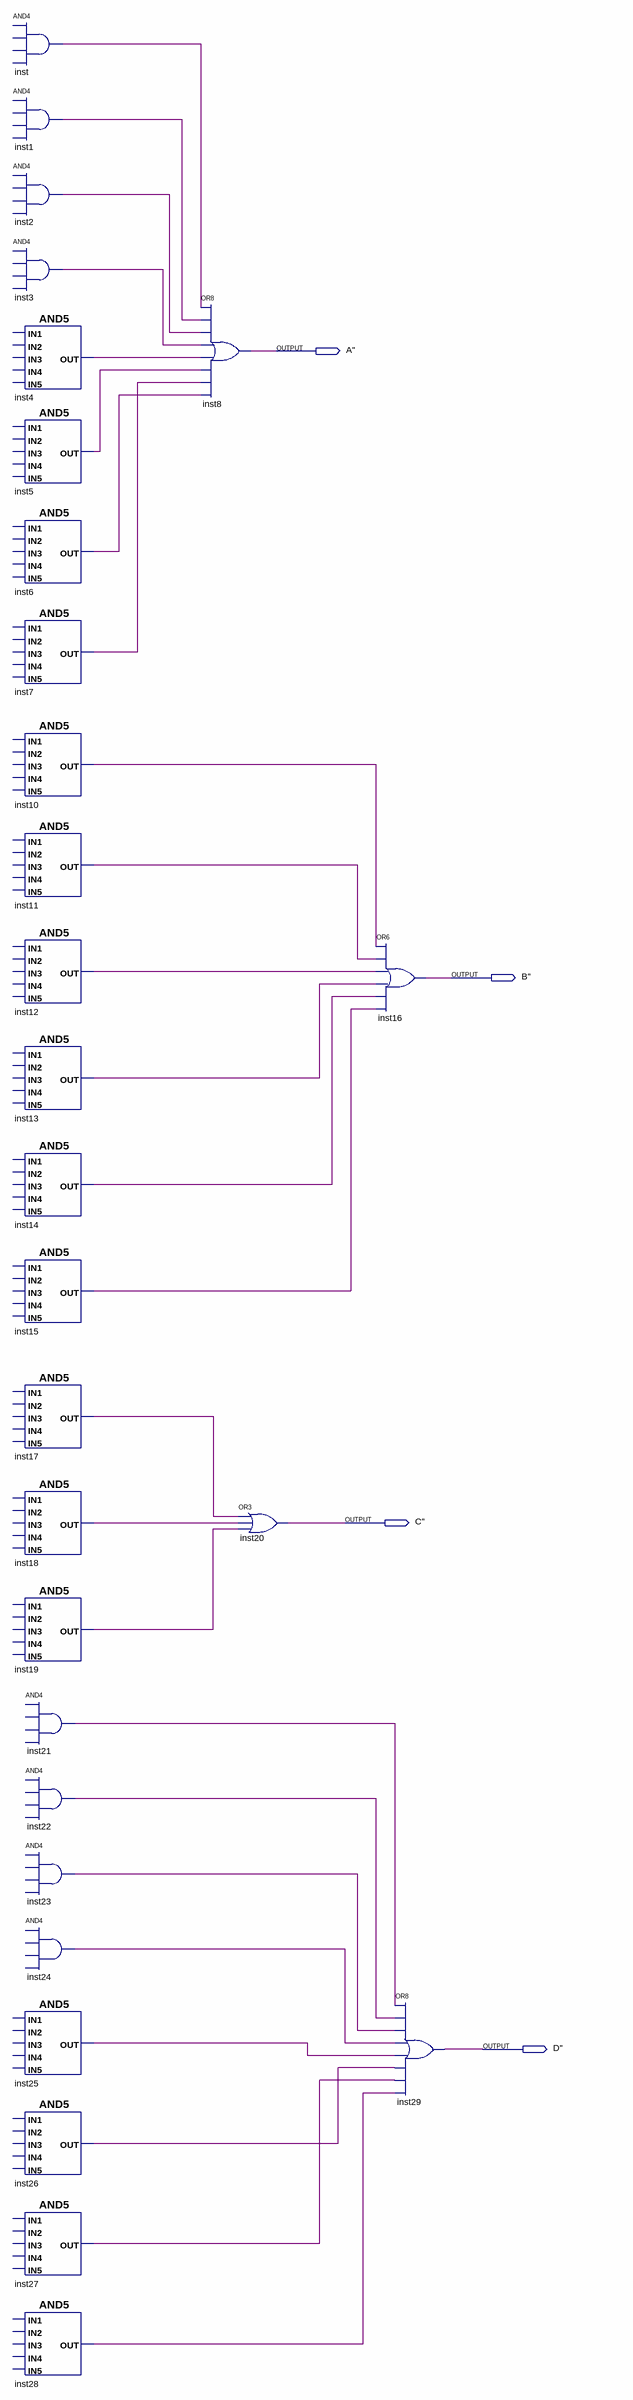
[diagram p0: schematic sheet]
// Quartus schematic Block2.bdf as structural Verilog: 29 symbols, 4 pins
module Block2 (
  output \A'' ,
  output \B'' ,
  output \C'' ,
  output \D'' 
);

  wire inst1_out, inst2_out, inst3_out, inst4_out, inst5_out, inst6_out, inst7_out, inst10_out, inst11_out,
       inst12_out, inst13_out, inst14_out, inst15_out, inst17_out, inst18_out, inst19_out, inst21_out,
       inst22_out, inst23_out, inst24_out, inst25_out, inst26_out, inst27_out, inst28_out, inst_out;

  // AND4 inst has open pins: IN1=open, IN2=open, IN3=open, IN4=open, OUT=inst_out
  // AND4 inst1 has open pins: IN1=open, IN2=open, IN3=open, IN4=open, OUT=inst1_out
  // AND4 inst2 has open pins: IN1=open, IN2=open, IN3=open, IN4=open, OUT=inst2_out
  // AND4 inst3 has open pins: IN1=open, IN2=open, IN3=open, IN4=open, OUT=inst3_out
  // AND5 inst4 has open pins: IN1=open, IN2=open, IN3=open, IN4=open, IN5=open, OUT=inst4_out
  // AND5 inst5 has open pins: IN1=open, IN2=open, IN3=open, IN4=open, IN5=open, OUT=inst5_out
  // AND5 inst6 has open pins: IN1=open, IN2=open, IN3=open, IN4=open, IN5=open, OUT=inst6_out
  // AND5 inst7 has open pins: IN1=open, IN2=open, IN3=open, IN4=open, IN5=open, OUT=inst7_out
  // AND5 inst10 has open pins: IN1=open, IN2=open, IN3=open, IN4=open, IN5=open, OUT=inst10_out
  // AND5 inst11 has open pins: IN1=open, IN2=open, IN3=open, IN4=open, IN5=open, OUT=inst11_out
  // AND5 inst12 has open pins: IN1=open, IN2=open, IN3=open, IN4=open, IN5=open, OUT=inst12_out
  // AND5 inst13 has open pins: IN1=open, IN2=open, IN3=open, IN4=open, IN5=open, OUT=inst13_out
  // AND5 inst14 has open pins: IN1=open, IN2=open, IN3=open, IN4=open, IN5=open, OUT=inst14_out
  // AND5 inst15 has open pins: IN1=open, IN2=open, IN3=open, IN4=open, IN5=open, OUT=inst15_out
  // AND5 inst17 has open pins: IN1=open, IN2=open, IN3=open, IN4=open, IN5=open, OUT=inst17_out
  // AND5 inst18 has open pins: IN1=open, IN2=open, IN3=open, IN4=open, IN5=open, OUT=inst18_out
  // AND5 inst19 has open pins: IN1=open, IN2=open, IN3=open, IN4=open, IN5=open, OUT=inst19_out
  // AND4 inst21 has open pins: IN1=open, IN2=open, IN3=open, IN4=open, OUT=inst21_out
  // AND4 inst22 has open pins: IN1=open, IN2=open, IN3=open, IN4=open, OUT=inst22_out
  // AND4 inst23 has open pins: IN1=open, IN2=open, IN3=open, IN4=open, OUT=inst23_out
  // AND4 inst24 has open pins: IN1=open, IN2=open, IN3=open, IN4=open, OUT=inst24_out
  // AND5 inst25 has open pins: IN1=open, IN2=open, IN3=open, IN4=open, IN5=open, OUT=inst25_out
  // AND5 inst26 has open pins: IN1=open, IN2=open, IN3=open, IN4=open, IN5=open, OUT=inst26_out
  // AND5 inst27 has open pins: IN1=open, IN2=open, IN3=open, IN4=open, IN5=open, OUT=inst27_out
  // AND5 inst28 has open pins: IN1=open, IN2=open, IN3=open, IN4=open, IN5=open, OUT=inst28_out
  or inst8 (\A'' , inst_out, inst1_out, inst2_out, inst3_out, inst4_out, inst5_out, inst7_out, inst6_out);
  or inst20 (\C'' , inst17_out, inst18_out, inst19_out);
  or inst16 (\B'' , inst10_out, inst11_out, inst12_out, inst13_out, inst14_out, inst15_out);
  or inst29 (\D'' , inst21_out, inst22_out, inst23_out, inst24_out, inst25_out, inst26_out, inst27_out, inst28_out);
endmodule
